# Altium schematic sheet BatuhanErbilBoostConverter.SchDoc
size A4; SheetNumber: 1; SheetTotal: 1
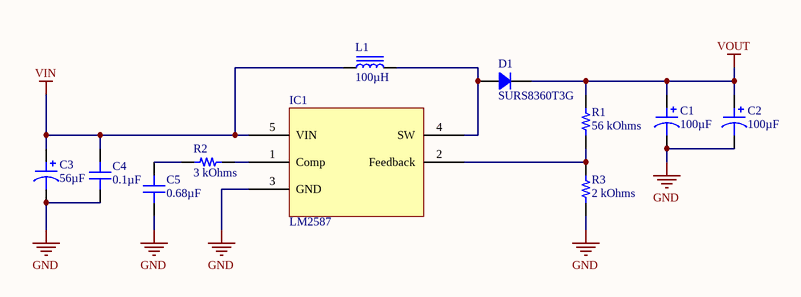
[diagram p0: BatuhanErbilBoostConverter.SchDoc]

## Parts
C1  100µF  [CAP ALSMD 8.3MM H10.5MM]
C2  100µF  [CAP ALSMD 8.3MM H10.5MM]
C3  56µF  [CAP ALSMD 6.6MM H7.7MM]
C4  0.1µF  [CAP 0805_2012]
C5  0.68µF  [CAP 0805_2012]
D1  SURS8360T3G  [DO214AB SMC]
IC1  LM2587  [D2PAK]
L1  100µH  [7447070]
R1  56 kOhms  [RES 0805_2012]
R2  3 kOhms  [RES 0805_2012]
R3  2 kOhms  [RES 0805_2012]

## Nets
GND: C1.2 C2.2 C3.2 C4.1 C5.1 IC1.3(GND) R3.1
VIN: C3.1 C4.2 IC1.5(VIN) L1.1
VOUT: C1.1 C2.1 D1.2 R1.2
NetC5_2: C5.2 R2.1
NetD1_1: D1.1 IC1.4(SW) L1.2
NetIC1_1: IC1.1(Comp) R2.2
NetIC1_2: IC1.2(Feedback) R1.1 R3.2

## Library data of the parts
C1 C2 = EEE-FK1H101P: CAP ALUM 100UF 20% 50V SMD; Manufacturer: Panasonic Electronic Components; Impedance: 340 mOhms; Lifetime @ Temp.: 2000 Hrs @ 105°C; Polarization: Polar; Ripple Current @ High Frequency: 350mA @ 100kHz; Ripple Current @ Low Frequency: 262.5mA @ 120Hz; Surface Mount Land Size: 0.327" L x 0.327" W (8.30mm x 8.30mm); Part Number: EEE-FK1H101P; Applications: Automotive; Capacitance: 100µF; ComponentLink2Description: DigiKey Link; ComponentLink2URL: http://digikey.com/product-detail/en/panasonic-electronic-components/EEE-FK1H101P/PCE3809CT-ND/766185; Device Package: Radial, Can - SMD; Height - Seated (Max): 0.413" (10.50mm); LastUpdated: 2.09.2020 01:25:16; Lifecycle Status: Active; Minimum Order: 1; Mounting Type: Surface Mount; Operating Temperature: -55°C ~ 105°C; Package / Case: Radial, Can - SMD; Packaging: TapeAndReel; PartId: 7485; Part Status: Active; Price: 0.25; Ratings: AEC-Q200; Series: FK; Size / Dimension: 0.315" Dia (8.00mm); Supplier 1: DigiKey; Supplier Part Number 1: PCE3809CT-ND; Tolerance: ±20%; Value: 100µF; Voltage - Rated: 50V
C3 = UWD1V560MCL1GS: CAP ALUM 56UF 20% 35V SMD; Manufacturer: Nichicon; Impedance: 340 mOhms; Lifetime @ Temp.: 2000 Hrs @ 105°C; Ripple Current @ High Frequency: 280mA @ 100kHz; Ripple Current @ Low Frequency: 140mA @ 120Hz; Surface Mount Land Size: 0.260" L x 0.260" W (6.60mm x 6.60mm); Part Number: UWD1V560MCL1GS; Applications: General Purpose; Capacitance: 56µF; ComponentLink1Description: Datasheet; ComponentLink1URL: http://nichicon-us.com/english/products/pdfs/e-uwd.pdf; ComponentLink2Description: DigiKey Link; ComponentLink2URL: http://digikey.com/product-detail/en/nichicon/UWD1V560MCL1GS/493-9694-1-ND/3963026; Device Package: Radial, Can - SMD; Height - Seated (Max): 0.303" (7.70mm); LastUpdated: 2.09.2020 01:25:35; Lifecycle Status: Active; Minimum Order: 1; Mounting Type: Surface Mount; Operating Temperature: -55°C ~ 105°C; Package / Case: Radial, Can - SMD; Packaging: TapeAndReel; PartId: 8221; Part Status: Active; Price: 0.27; Series: UWD; Size / Dimension: 0.248" Dia (6.30mm); Supplier 1: DigiKey; Supplier Part Number 1: 493-9694-1-ND; Tolerance: ±20%; Value: 56µF; Voltage - Rated: 35V
C4 = CC0805JRX7R9BB104: CAP CER 0.1UF 50V X7R 0805; Manufacturer: Yageo; Tolerance: ±5%; Part Number: CC0805JRX7R9BB104; Value: 0.1µF; Applications: General Purpose; Capacitance: 0.1µF; ComponentLink1Description: Datasheet; ComponentLink1URL: https://www.yageo.com/upload/media/product/productsearch/datasheet/mlcc/UPY-GPHC_X7R_6.3V-to-50V_18.pdf; ComponentLink2Description: DigiKey Link; ComponentLink2URL: http://digikey.com/product-detail/en/yageo/CC0805JRX7R9BB104/311-1858-1-ND/5195760; Device Package: 0805 (2012 Metric); LastUpdated: 2.09.2020 01:04:41; Lifecycle Status: Active; Minimum Order: 1; Mounting Type: Surface Mount, MLCC; Operating Temperature: -55°C ~ 125°C; Package / Case: 0805 (2012 Metric); Packaging: TapeAndReel; PartId: 2626; Part Status: Active; Price: 0.03; Series: CC; Size / Dimension: 0.079" L x 0.049" W (2.00mm x 1.25mm); Supplier 1: DigiKey; Supplier Part Number 1: 311-1858-1-ND; Temperature Coefficient: X7R; Thickness (Max): 0.037" (0.95mm); Voltage - Rated: 50V
C5 = C0805C684K5RACAUTO: CAP CER 0.68UF 50V X7R 0805; Manufacturer: KEMET; Tolerance: ±10%; Part Number: C0805C684K5RACAUTO; Value: 0.68µF; Applications: Automotive, Bypass, Decoupling; Capacitance: 0.68µF; ComponentLink1Description: Datasheet; ComponentLink1URL: https://api.kemet.com/component-edge/download/datasheet/C0805C684K5RACAUTO.pdf; ComponentLink2Description: DigiKey Link; ComponentLink2URL: http://digikey.com/product-detail/en/kemet/C0805C684K5RACAUTO/399-15904-1-ND/7516404; Device Package: 0805 (2012 Metric); LastUpdated: 2.09.2020 01:04:17; Lifecycle Status: Active; Minimum Order: 1; Mounting Type: Surface Mount, MLCC; Operating Temperature: -55°C ~ 125°C; Package / Case: 0805 (2012 Metric); Packaging: TapeAndReel; PartId: 15110; Part Status: Active; Price: 0.08; Ratings: AEC-Q200; Series: SMD Auto X7R; Size / Dimension: 0.079" L x 0.049" W (2.00mm x 1.25mm); Supplier 1: DigiKey; Supplier Part Number 1: 399-15904-1-ND; Temperature Coefficient: X7R; Thickness (Max): 0.057" (1.45mm); Voltage - Rated: 50V
D1 = SURS8360T3G: DIODE GEN PURP 600V 3A SMC; Manufacturer: ON Semiconductor; Current - Reverse Leakage @ Vr: 10µA @ 600V; Diode Type: Standard; Reverse Recovery Time (trr): 75ns; Speed: Fast Recovery =< 500ns, > 200mA (Io); Voltage - Forward (Vf) (Max) @ If: 1.25V @ 3A; Part Number: SURS8360T3G; ComponentLink1Description: Datasheet; ComponentLink1URL: http://www.onsemi.com/pub/Collateral/MURS320T3-D.PDF; ComponentLink2Description: DigiKey Link; ComponentLink2URL: http://digikey.com/product-detail/en/on-semiconductor/SURS8360T3G/SURS8360T3GOSCT-ND/9087771; Current - Average Rectified (Io): 3A; LastUpdated: 2.09.2020 01:18:57; Lifecycle Status: Active; Minimum Order: 1; Mounting Type: Surface Mount; Operating Temperature - Junction: -65°C ~ 175°C; Package / Case: DO-214AB, SMC; Packaging: TapeAndReel; PartId: 348; Part Status: Active; Price: 0.30; Series: -; Supplier 1: DigiKey; Supplier Part Number 1: SURS8360T3GOSCT-ND; Supplier Device Package: SMC; Voltage - DC Reverse (Vr) (Max): 600V
IC1 = LM2587: Boost Converter
L1 = SRR1280-101M: FIXED IND 100UH 2.1A 150MOHM SMD; Manufacturer: Bourns Inc.; Current - Saturation: 2A; DC Resistance (DCR): 150mOhm Max; Frequency - Self Resonant: 4.5MHz; Inductance Frequency - Test: 100kHz; Material - Core: Ferrite; Q @ Freq: 18 @ 796kHz; Shielding: Shielded; Tolerance: ±20%; Type: Wirewound; Part Number: SRR1280-101M; ComponentLink1Description: Datasheet; ComponentLink1URL: https://www.bourns.com/docs/Product-Datasheets/SRR1280.pdf; ComponentLink2Description: DigiKey Link; ComponentLink2URL: http://digikey.com/product-detail/en/bourns-inc/SRR1280-101M/SRR1280-101MCT-ND/2127046; Current Rating (Amps): 2.1A; Device Package: Nonstandard; Height - Seated (Max): 0.315" (8.00mm); Inductance: 100µH; LastUpdated: 2.09.2020 01:22:09; Lifecycle Status: Active; Minimum Order: 1; Mounting Type: Surface Mount; Operating Temperature: -40°C ~ 125°C; Package / Case: Nonstandard; Packaging: TapeAndReel; PartId: 24; Part Status: Active; Price: 0.65; Series: SRR1280; Size / Dimension: 0.492" L x 0.492" W (12.50mm x 12.50mm); Supplier 1: DigiKey; Supplier Part Number 1: SRR1280-101MCT-ND; Value: 100µH
R1 = RMCF0805JT56K0: RES 56K OHM 5% 1/8W 0805; Manufacturer: Stackpole Electronics Inc; Power (Watts): 0.125W, 1/8W; Temperature Coefficient: ±200ppm/°C; Part Number: RMCF0805JT56K0; Value: 56 kOhms; ComponentLink1Description: Datasheet; ComponentLink1URL: https://www.seielect.com/catalog/sei-rmcf_rmcp.pdf; ComponentLink2Description: DigiKey Link; ComponentLink2URL: http://digikey.com/product-detail/en/stackpole-electronics-inc/RMCF0805JT56K0/RMCF0805JT56K0CT-ND/1942590; Composition: Thick Film; Device Package: 0805 (2012 Metric); Features: Automotive AEC-Q200; Height - Seated (Max): 0.026" (0.65mm); LastUpdated: 2.09.2020 01:14:46; Lifecycle Status: Active; Minimum Order: 1; Number of Terminations: 2; Operating Temperature: -55°C ~ 155°C; Package / Case: 0805 (2012 Metric); Packaging: CutTape; PartId: 44631; Part Status: Active; Price: 0.10; Ratings: AEC-Q200; Resistance: 56 kOhms; Series: RMCF; Size / Dimension: 0.079" L x 0.049" W (2.00mm x 1.25mm); Supplier 1: DigiKey; Supplier Part Number 1: RMCF0805JT56K0CT-ND; Supplier Device Package: 0805; Tolerance: ±5%
R2 = ERJ-6ENF3001V: RES SMD 3K OHM 1% 1/8W 0805; Manufacturer: Panasonic Electronic Components; Power (Watts): 0.125W, 1/8W; Temperature Coefficient: ±100ppm/°C; Part Number: ERJ-6ENF3001V; Value: 3 kOhms; ComponentLink1Description: Datasheet; ComponentLink1URL: https://industrial.panasonic.com/cdbs/www-data/pdf/RDA0000/AOA0000C304.pdf; ComponentLink2Description: DigiKey Link; ComponentLink2URL: http://digikey.com/product-detail/en/panasonic-electronic-components/ERJ-6ENF3001V/P3.0KCCT-ND/1746847; Composition: Thick Film; Device Package: 0805 (2012 Metric); Features: Automotive AEC-Q200; Height - Seated (Max): 0.028" (0.70mm); LastUpdated: 2.09.2020 01:15:19; Lifecycle Status: Active; Minimum Order: 1; Number of Terminations: 2; Operating Temperature: -55°C ~ 155°C; Package / Case: 0805 (2012 Metric); Packaging: TapeAndReel; PartId: 30109; Part Status: Active; Price: 0.01; Ratings: AEC-Q200; Resistance: 3 kOhms; Series: ERJ; Size / Dimension: 0.079" L x 0.049" W (2.00mm x 1.25mm); Supplier 1: DigiKey; Supplier Part Number 1: P3.0KCCT-ND; Supplier Device Package: 0805; Tolerance: ±1%
R3 = AC0805FR-072KL: RES SMD 2K OHM 1% 1/8W 0805; Manufacturer: Yageo; Power (Watts): 0.125W, 1/8W; Temperature Coefficient: ±100ppm/°C; Part Number: AC0805FR-072KL; Value: 2 kOhms; ComponentLink1Description: Datasheet; ComponentLink1URL: https://www.yageo.com/upload/media/product/productsearch/datasheet/rchip/PYu-AC_51_RoHS_L_7.pdf; ComponentLink2Description: DigiKey Link; ComponentLink2URL: http://digikey.com/product-detail/en/yageo/AC0805FR-072KL/YAG3718CT-ND/6006567; Composition: Thick Film; Device Package: 0805 (2012 Metric); Features: Automotive AEC-Q200, Moisture Resistant; Height - Seated (Max): 0.024" (0.60mm); LastUpdated: 2.09.2020 01:15:09; Lifecycle Status: Active; Minimum Order: 1; Number of Terminations: 2; Operating Temperature: -55°C ~ 155°C; Package / Case: 0805 (2012 Metric); Packaging: TapeAndReel; PartId: 34654; Part Status: Active; Price: 0.01; Ratings: AEC-Q200; Resistance: 2 kOhms; Series: AC; Size / Dimension: 0.079" L x 0.049" W (2.00mm x 1.25mm); Supplier 1: DigiKey; Supplier Part Number 1: YAG3718CT-ND; Supplier Device Package: 0805; Tolerance: ±1%